# Altium schematic sheet DRV8874.SchDoc
size A; SheetNumber: 1; SheetTotal: 1
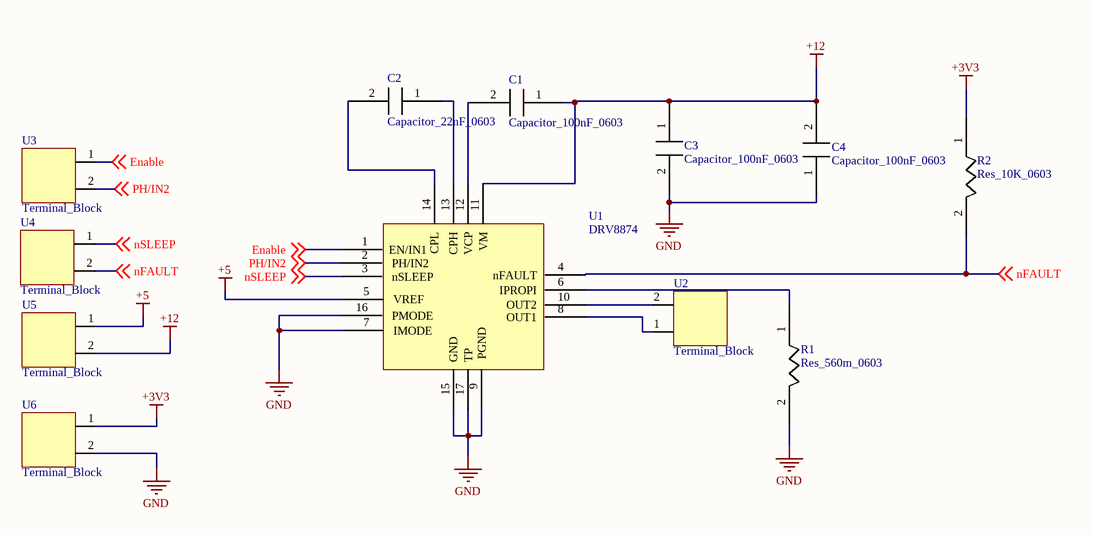
[diagram p0: DRV8874.SchDoc]

## Parts
C1  Capacitor_100nF_0603  [Capacitor_0603]
C2  Capacitor_22nF_0603  [Capacitor_0603]
C3  Capacitor_100nF_0603  [Capacitor_0603]
C4  Capacitor_100nF_0603  [Capacitor_0603]
R1  Res_560m_0603  [Res_10K_0603]
R2  Res_10K_0603  [Res_10K_0603]
U1  DRV8874  [DRV8874]
U2  Terminal_Block  [Terminal_Block]
U3  Terminal_Block  [Terminal_Block]
U4  Terminal_Block  [Terminal_Block]
U5  Terminal_Block  [Terminal_Block]
U6  Terminal_Block  [Terminal_Block]

## Nets
+3V3: R2.1 U6.1
+5: U1.5(VREF) U5.1
+12: C1.1 C3.1 C4.2 U1.11(VM) U5.2
GND: C3.2 C4.1 R1.2 U1.7(IMODE) U1.9(PGND) U1.15(GND) U1.16(PMODE) U1.17(TP) U6.2
Enable: U1.1(EN/IN1) U3.1 ; off-sheet Enable
nFAULT: R2.2 U1.4(nFAULT) U4.2 ; off-sheet nFAULT
nSLEEP: U1.3(nSLEEP) U4.1 ; off-sheet nSLEEP
PH/IN2: U1.2(PH/IN2) U3.2 ; off-sheet PH/IN2
NetC1_2: C1.2 U1.12(VCP)
NetC2_1: C2.1 U1.13(CPH)
NetC2_2: C2.2 U1.14(CPL)
NetR1_1: R1.1 U1.6(IPROPI)
NetU1_8: U1.8(OUT1) U2.1
NetU1_10: U1.10(OUT2) U2.2

## Library data of the parts
U1 = DRV8874: Manufacturer: Texas instruments; Supplier: LCSC